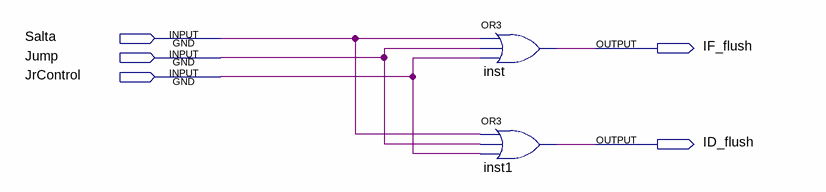
[diagram p0: schematic sheet]
// Quartus schematic Discard_Instr.bdf as structural Verilog: 2 symbols, 5 pins
module Discard_Instr (
  input  Salta,
  input  Jump,
  input  JrControl,
  output IF_flush,
  output ID_flush
);

  or inst (IF_flush, Salta, Jump, JrControl);
  or inst1 (ID_flush, Salta, Jump, JrControl);
endmodule
